# Altium schematic sheet Harware_PID.SchDoc
size B; SheetNumber: 1; SheetTotal: 1
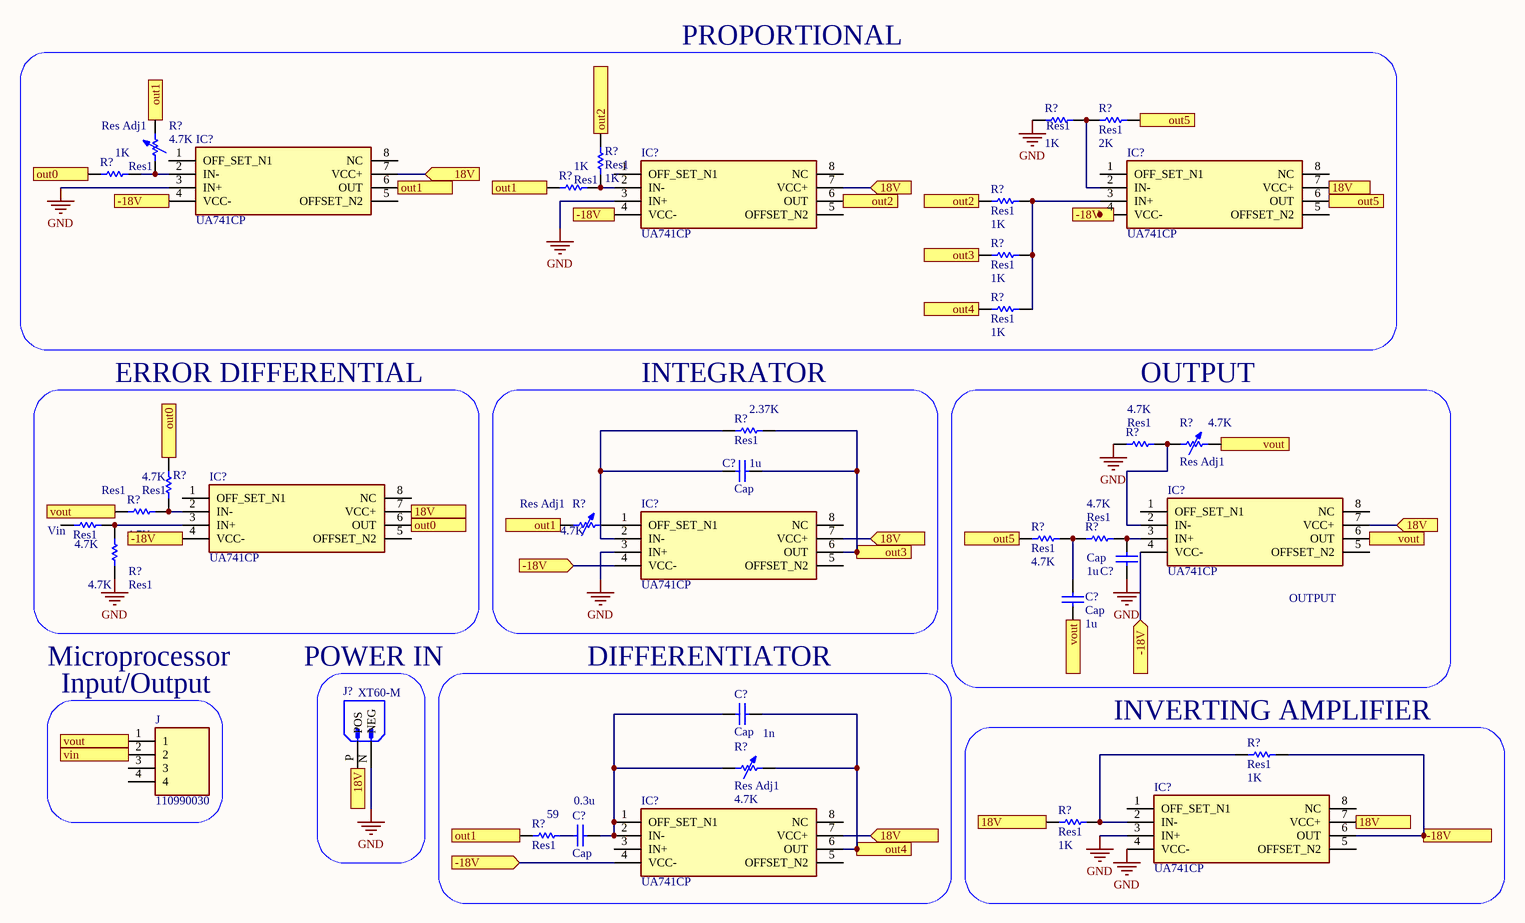
[diagram p0: Harware_PID.SchDoc]

## Parts
(Parts that share a designator on the sheet are numbered #1, #2 ... from top to bottom, then left to right.)
C?#1  Cap  value 1u  [RAD-0.3]
C?#2  Cap  value 1u  [RAD-0.3]
C?#3  Cap  value 1u  [RAD-0.3]
C?#4  Cap  value 1n  [RAD-0.3]
C?#5  Cap  value 0.3u  [RAD-0.3]
IC?#1  UA741CP  [DIP794W53P254L959H508Q8N]
IC?#2  UA741CP  [DIP794W53P254L959H508Q8N]
IC?#3  UA741CP  [DIP794W53P254L959H508Q8N]
IC?#4  UA741CP  [DIP794W53P254L959H508Q8N]
IC?#5  UA741CP  [DIP794W53P254L959H508Q8N]
IC?#6  UA741CP  [DIP794W53P254L959H508Q8N]
IC?#7  UA741CP  [DIP794W53P254L959H508Q8N]
IC?#8  UA741CP  [DIP794W53P254L959H508Q8N]
J  110990030  [SEEED_110990030]
J?  XT60-M  [AMASS_XT60-M]
R?#1  Res1  value 1K  [AXIAL-0.3]
R?#2  Res1  value 2K  [AXIAL-0.3]
R?#3  Res1  value 1K  [AXIAL-0.3]
R?#4  Res Adj1  value 4.7K  [AXIAL-0.7]
R?#5  Res1  value 1K  [AXIAL-0.3]
R?#6  Res1  value 1K  [AXIAL-0.3]
R?#7  Res1  value 1K  [AXIAL-0.3]
R?#8  Res1  value 1K  [AXIAL-0.3]
R?#9  Res1  value 1K  [AXIAL-0.3]
R?#10  Res1  value 2.37K  [AXIAL-0.3]
R?#11  Res1  value 4.7K  [AXIAL-0.3]
R?#12  Res Adj1  value 4.7K  [AXIAL-0.7]
R?#13  Res1  value 4.7K  [AXIAL-0.3]
R?#14  Res1  value 4.7K  [AXIAL-0.3]
R?#15  Res1  value 4.7K  [AXIAL-0.3]
R?#16  Res Adj1  value 4.7K  [AXIAL-0.7]
R?#17  Res1  value 4.7K  [AXIAL-0.3]
R?#18  Res1  value 4.7K  [AXIAL-0.3]
R?#19  Res1  value 4.7K  [AXIAL-0.3]
R?#20  Res Adj1  value 4.7K  [AXIAL-0.7]
R?#21  Res1  value 1K  [AXIAL-0.3]
R?#22  Res1  value 59  [AXIAL-0.3]
R?#23  Res1  value 1K  [AXIAL-0.3]

## Blocks framed on the sheet
PROPORTIONAL: IC?#1-IC?#3 R?#1-R?#9
ERROR DIFFERENTIAL: IC?#4 R?#13-R?#15 R?#19
INTEGRATOR: C?#1 IC?#6 R?#10 R?#16
OUTPUT: C?#2 C?#3 IC?#5 R?#11 R?#12 R?#17 R?#18
DIFFERENTIATOR: C?#4 C?#5 IC?#8 R?#20 R?#22
Input/Output: J
INVERTING AMPLIFIER: IC?#7 R?#21 R?#23

## Ports
18V (in), -18V (in), -18V (out), out0 (in), out0 (out), out1 (in), out1 (out), out2 (in), out2 (out), out3 (in), out3 (out), out4 (in), out4 (out), out5 (in), out5 (out), vin (out), vout (in), vout (out)

## Nets
GND: C?#2.1 IC?#1.3(IN+) IC?#2.3(IN+) IC?#6.3(IN+) IC?#7.3(IN+) IC?#7.4(VCC-) J?.N(NEG) R?#1.1 R?#11.1 R?#19.1
18V: IC?#1.7(VCC+) IC?#2.7(VCC+) IC?#3.7(VCC+) IC?#4.7(VCC+) IC?#5.7(VCC+) IC?#6.7(VCC+) IC?#7.7(VCC+) IC?#8.7(VCC+) J?.P(POS) R?#23.2 ; port 18V
-18V: IC?#1.4(VCC-) IC?#2.4(VCC-) IC?#4.4(VCC-) IC?#5.4(VCC-) IC?#6.4(VCC-) IC?#7.6(OUT) IC?#8.4(VCC-) R?#21.1 ; port -18V
out0: IC?#4.6(OUT) R?#3.1 R?#14.2 ; port out0
out1: IC?#1.6(OUT) R?#4.2 R?#5.1 R?#16.1 R?#22.1 ; port out1
out2: IC?#2.6(OUT) R?#6.2 R?#7.1 ; port out2
out3: C?#1.2 IC?#6.6(OUT) R?#8.2 R?#10.2 ; port out3
out4: C?#4.2 IC?#8.6(OUT) R?#9.2 R?#20.2 ; port out4
out5: IC?#3.6(OUT) R?#2.2 R?#17.1 ; port out5
vin: J.2 ; port vin
vout: C?#3.1 IC?#5.6(OUT) J.1 R?#12.2 R?#13.1 ; port vout
NetC?#1_1: C?#1.1 IC?#6.2(IN-) R?#10.1
NetC?#2_2: C?#2.2 IC?#5.3(IN+) R?#18.2
NetC?#3_2: C?#3.2 R?#17.2 R?#18.1
NetC?#4_1: C?#4.1 C?#5.2 IC?#8.1(OFF_SET_N1) IC?#8.2(IN-) R?#20.1
NetC?#5_1: C?#5.1 R?#22.2
NetIC?#1_2: IC?#1.2(IN-) R?#3.2 R?#4.1
NetIC?#2_2: IC?#2.2(IN-) R?#5.2 R?#6.1
NetIC?#3_2: IC?#3.2(IN-) R?#1.2 R?#2.1
NetIC?#3_3: IC?#3.3(IN+) R?#7.2 R?#8.1 R?#9.1
NetIC?#4_2: IC?#4.2(IN-) R?#13.2 R?#14.1
NetIC?#4_3: IC?#4.3(IN+) R?#15.2 R?#19.2
NetIC?#5_2: IC?#5.2(IN-) R?#11.2 R?#12.1
NetIC?#6_1: IC?#6.1(OFF_SET_N1) R?#16.2
NetIC?#7_2: IC?#7.2(IN-) R?#21.2 R?#23.1

Not connected (* = marked no-connect by the designer): IC?#1 1(OFF_SET_N1) 5(OFFSET_N2) 8(NC); IC?#2 1(OFF_SET_N1) 5(OFFSET_N2) 8(NC); IC?#3 1(OFF_SET_N1) 4(VCC-) 5(OFFSET_N2) 8(NC); IC?#4 1(OFF_SET_N1) 5(OFFSET_N2) 8(NC); IC?#5 1(OFF_SET_N1) 5(OFFSET_N2) 8(NC); IC?#6 5(OFFSET_N2) 8(NC); IC?#7 1(OFF_SET_N1) 5(OFFSET_N2) 8(NC); IC?#8 3(IN+) 5(OFFSET_N2) 8(NC); J 3 4; R?#15 1

## Notes on the sheet
- (near R?#15) Vin
- (near IC?#5) OUTPUT
- Microprocessor
- POWER IN

## Library data of the parts
C?#1-C?#5 = Cap: Capacitor; Published: 8-Jun-2000; LatestRevisionDate: 17-Jul-2002; LatestRevisionNote: Re-released for DXP Platform.; PackageReference: RAD-0.3; Publisher: Altium Limited; PackageDescription: Radial Cap, Thru-Hole; 2 Leads; 0.3 in Pin Spacing
IC?#1-IC?#8 = UA741CP: Integrated Circuit; Manufacturer_Name: Texas Instruments; Datasheet Link: http://www.ti.com/lit/ds/symlink/ua741.pdf; Height: 5.08mm; Mouser2 Part Number: 595-UA741CP; Mouser2 Price/Stock: https://www.mouser.com/Search/Refine.aspx?Keyword=595-UA741CP; Manufacturer_Part_Number: UA741CP
J = 110990030: GROVE 2MM 4PIN VERT CONN 10PCS; MF: Seeed Technology; Arrow_Electronics-Purchase-URL: https://snapeda.com/shop?store=Arrow+Electronics&id=583576; Availability: Good; Package: None; Price: None; Mouser-Purchase-URL: https://snapeda.com/shop?store=Mouser&id=583576; MP: 110990030; SnapEDA_Link: https://www.snapeda.com/parts/110990030/Seeed%20Technology%20Co.,%20Ltd/view-part/583576/?ref=snap; Value: *
J? = XT60-M: Plug; DC supply; XT60; male; PIN: 2; for cable; soldered; 30A; 500V; MF: AMASS; Package: Package; Availability: Not in stock; SnapEDA_Link: https://www.snapeda.com/parts/XT60-M/AMASS/view-part/?ref=snap; Check_prices: https://www.snapeda.com/parts/XT60-M/AMASS/view-part/?ref=eda; MP: XT60-M; Price: None; Value: *
R?#1-R?#3 R?#5-R?#11 R?#13-R?#15 R?#17-R?#19 R?#21-R?#23 = Res1: Resistor; Published: 8-Jun-2000; LatestRevisionDate: 17-Jul-2002; LatestRevisionNote: Re-released for DXP Platform.; PackageReference: AXIAL-0.3; Publisher: Altium Limited; PackageDescription: Axial Device, Thru-Hole; 2 Leads; 0.3 in Pin Spacing
R?#4 R?#12 R?#16 R?#20 = Res Adj1: Variable Resistor; Set Position: 0.5; Published: 8-Jun-2000; LatestRevisionDate: 17-Jul-2002; LatestRevisionNote: Re-released for DXP Platform.; PackageReference: AXIAL-0.7; Publisher: Altium Limited; PackageDescription: Axial Device, Thru-Hole; 2 Leads; 0.7 in Pin Spacing